# Altium schematic sheet Power LED Circuit.SchDoc
size B; Organization: Altium Limited; Address1: L3, 12a Rodborough Rd; Address2: Frenchs Forest; Address3: NSW; Address4: Australia 2086; SheetNumber: 1; SheetTotal: 1
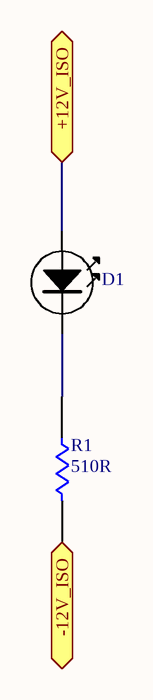
[diagram p0: Power LED Circuit.SchDoc]

## Parts
D1  LED Diode_Green  [D0805]  (value not drawn)
R1  Resistance: 510R  [RES0805_New]  (hidden comment: ERJ-PB6B5100V)

## Ports
+12V_ISO, -12V_ISO

## Nets
+12V_ISO: D1.2 ; port +12V_ISO
-12V_ISO: R1.2 ; port -12V_ISO
NetD1_1: D1.1 R1.1

## Notes on the sheet
- Title:
- Size:
- B
- Document Number:
- Revision:
- Designer:
- Approval Date:
- Start Date:
- MM/DD/YY
- --/--/--
- Sheet:
- of
- Approver:
- CONFIDENTIAL
- Project Name/Number:

## Library data of the parts
R1 = ERJ-PB6B5100V: RES SMD 510 OHM 0.1% 1/4W 0805; Manufacturer: Panasonic; Max Power Dissipation: 250mW; Temperature Coefficient: 50ppm/°C; Supplier 1: Digi-Key; Manufacturer Part Number: ERJ-PB6B5100V; Stock 1: 4395; Pricing 1: 1=0.35, 10=0.298, 25=0.2164, 50=0.157, 100=0.1164, 250=0.0893, 500=0.0704, 1000=0.0487 (USD); Case/Package: 0805; Case Code (Metric): 2012; Case Code (Imperial): 0805; Min Operating Temperature: -55°C; Max Operating Temperature: 155°C; Packaging: Tape and Reel; Composition: Thick Film; Number of Terminations: 2; Tolerance: 0.1%; Length: 0.079inch; Width: 0.049inch; Height - Seated (Max): 0.028inch; ComponentLink1URL: https://industrial.panasonic.com/cdbs/www-data/pdf/RDA0000/AOA0000COL70.pdf; ComponentLink1Description: https://industrial.panasonic.com/cdbs/www-data/pdf/RDA0000/AOA0000COL70.pdf; Supplier Part Number 1: P20560CT-ND